# EAGLE design adc_newlayout_newcaps (EAGLE 5.07)
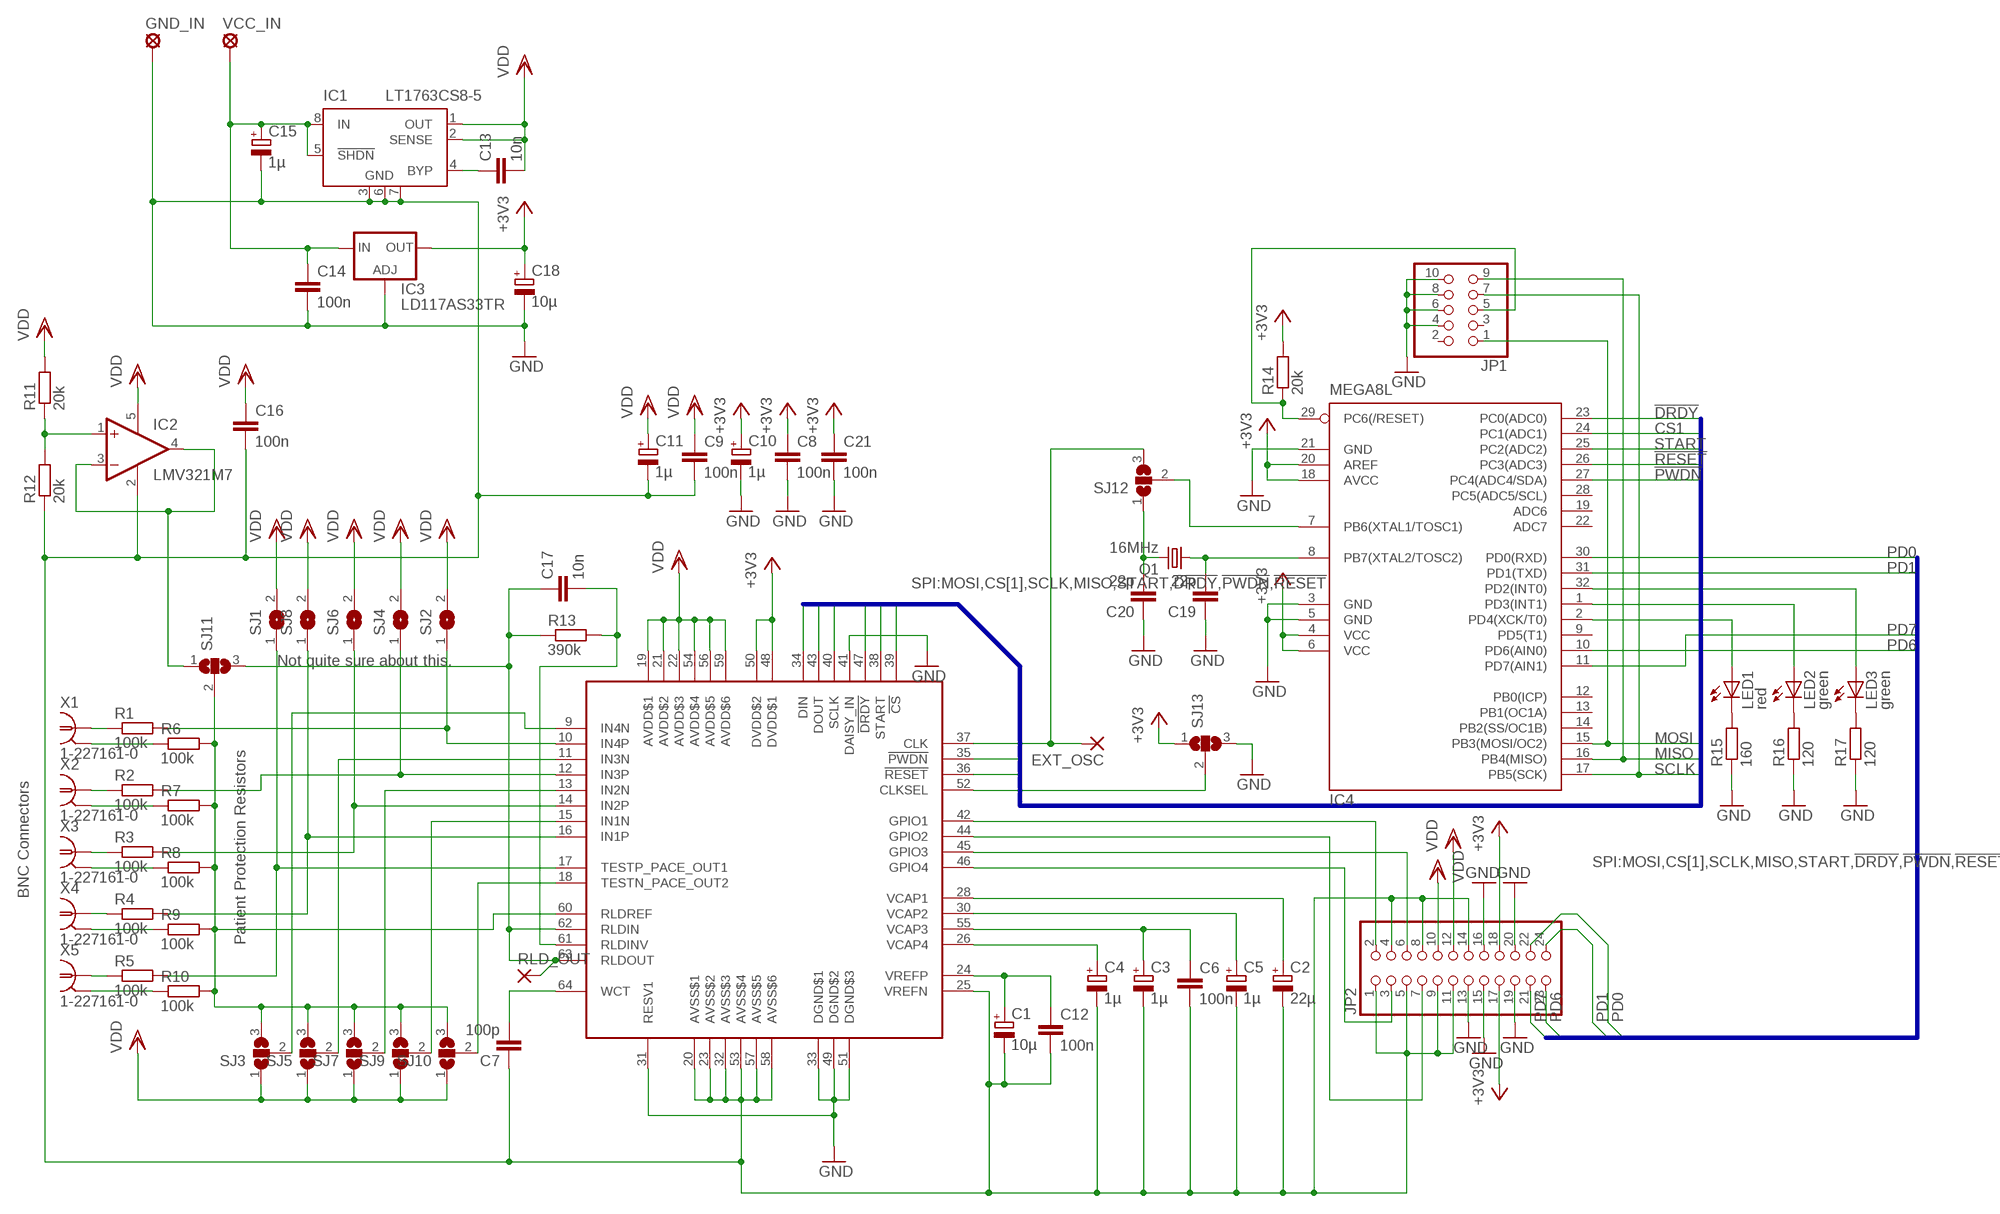
[diagram p0: schematic, sheet 1]

## Parts
C1  10µ  CPOL-EUSMCC  [SMC_C]
C2  22µ  CPOL-EUSMCD  [SMC_D]
C3  1µ  CPOL-EUSMCA  [SMC_A]
C4  1µ  CPOL-EUSMCA  [SMC_A]
C5  1µ  CPOL-EUSMCA  [SMC_A]
C6  100n  C-EUC1206  [C1206]
C7  100p  C-EUC1206  [C1206]
C8  100n  C-EUC1206  [C1206]
C9  100n  C-EUC1206  [C1206]
C10  1µ  CPOL-EUSMCA  [SMC_A]
C11  1µ  CPOL-EUSMCA  [SMC_A]
C12  100n  C-EUC1206  [C1206]
C13  10n  C-EUC1206  [C1206]
C14  100n  C-EUC1206  [C1206]
C15  1µ  CPOL-EUSMCA  [SMC_A]
C16  100n  C-EUC1206  [C1206]
C17  10n  C-EUC1206  [C1206]
C18  10µ  CPOL-EUSMCC  [SMC_C]
C19  22p  C-EUC1206  [C1206]
C20  22p  C-EUC1206  [C1206]
C21  100n  C-EUC1206  [C1206]
EXT_OSC  1,6/0,8  [1,6/0,8]
GND_IN  MCS10B  [MCS10B]
IC1  LT1763CS8-5  LT1763CS8-3.3  [SOIC8]
IC2  LMV321M7  [SC70-5L]
IC3  LD117AS33TR  [SOT223]
IC4  MEGA8L  MEGA8-AI  [TQFP32-08]
JP1  PINHD-2X5  [2X05]
JP2  PINHD-2X12  [2X12]
LED1  red  LEDCHIPLED_1206  [CHIPLED_1206]
LED2  green  LEDCHIPLED_1206  [CHIPLED_1206]
LED3  green  LEDCHIPLED_1206  [CHIPLED_1206]
Q1  16MHz  CRYSTALHC49UP  [HC49UP]
R1  100k  R-EU_R1206  [R1206]
R2  100k  R-EU_R1206  [R1206]
R3  100k  R-EU_R1206  [R1206]
R4  100k  R-EU_R1206  [R1206]
R5  100k  R-EU_R1206  [R1206]
R6  100k  R-EU_R1206  [R1206]
R7  100k  R-EU_R1206  [R1206]
R8  100k  R-EU_R1206  [R1206]
R9  100k  R-EU_R1206  [R1206]
R10  100k  R-EU_R1206  [R1206]
R11  20k  R-EU_R1206  [R1206]
R12  20k  R-EU_R1206  [R1206]
R13  390k  R-EU_R1206  [R1206]
R14  20k  R-EU_R1206  [R1206]
R15  160  R-EU_R1206  [R1206]
R16  120  R-EU_R1206  [R1206]
R17  120  R-EU_R1206  [R1206]
RLD_OUT  2,54/1,0  [2,54/1,0]
SJ1  SJ  [SJ]
SJ2  SJ  [SJ]
SJ3  SJ2W  [SJ_2]
SJ4  SJ  [SJ]
SJ5  SJ2W  [SJ_2]
SJ6  SJ  [SJ]
SJ7  SJ2W  [SJ_2]
SJ8  SJ  [SJ]
SJ9  SJ2W  [SJ_2]
SJ10  SJ2W  [SJ_2]
SJ11  SJ2W  [SJ_2]
SJ12  SJ2W  [SJ_2]
SJ13  SJ2W  [SJ_2]
U$1  ADS1194  [TQFP-64]
VCC_IN  MCS10B  [MCS10B]
X1  1-227161-0  [AMP_227161]
X2  1-227161-0  [AMP_227161]
X3  1-227161-0  [AMP_227161]
X4  1-227161-0  [AMP_227161]
X5  1-227161-0  [AMP_227161]

## Nets
!DRDY: IC4.23(PC0(ADC0)) U$1.47(!DRDY)
!PWDN: IC4.27(PC4(ADC4/SDA)) U$1.35(!PWDN)
!RESET: IC4.26(PC3(ADC3)) U$1.36(!RESET)
CS1: IC4.24(PC1(ADC1)) U$1.39(!CS)
GND: C1.- C2.- C3.- C4.- C5.- C6.2 C7.1 C8.2 C9.2 C10.- C11.- C12.2 C14.2 C15.- C16.2 C18.- C19.1 C20.1 C21.2 GND_IN.MP IC1.3(GND) IC1.6(GND) IC1.7(GND) IC2.2(V-) IC3.1(ADJ) IC4.3(GND) IC4.5(GND) IC4.21(GND) JP1.4 JP1.6 JP1.8 JP1.10 JP2.1 JP2.4 JP2.5 JP2.8 JP2.9 JP2.11 JP2.13 JP2.14 JP2.15 JP2.16 JP2.19 JP2.20 R12.1 R15.1 R16.1 R17.1 SJ13.3 U$1.20(AVSS$1) U$1.23(AVSS$2) U$1.25(VREFN) U$1.31(RESV1) U$1.32(AVSS$3) U$1.33(DGND$1) U$1.41(DAISY_IN) U$1.49(DGND$2) U$1.51(DGND$3) U$1.53(AVSS$4) U$1.57(AVSS$5) U$1.58(AVSS$6)
MISO: IC4.16(PB4(MISO)) JP1.9 U$1.43(DOUT)
MOSI: IC4.15(PB3(MOSI/OC2)) JP1.1 U$1.34(DIN)
N$1: C2.+ U$1.28(VCAP1)
N$2: C4.+ U$1.26(VCAP4)
N$3: C7.2 U$1.64(WCT)
N$4: C5.+ U$1.30(VCAP2)
N$5: C3.+ C6.1 U$1.55(VCAP3)
N$6: C1.+ C12.1 U$1.24(VREFP)
N$7: IC2.1(+IN) R11.1 R12.2
N$8: R1.2 SJ2.1 U$1.10(IN4P)
N$9: JP2.6 U$1.45(GPIO3)
N$10: R2.2 SJ4.1 U$1.12(IN3P)
N$11: C14.1 C15.+ IC1.5(!SHDN) IC1.8(IN) IC3.3(IN) VCC_IN.MP
N$12: R3.2 SJ6.1 U$1.14(IN2P)
N$13: R6.2 R7.2 R8.2 R9.2 R10.2 SJ3.3 SJ5.3 SJ7.3 SJ9.3 SJ10.3 SJ11.2 U$1.60(RLDREF)
N$14: R4.2 SJ8.1 U$1.16(IN1P)
N$15: R5.2 SJ1.1 U$1.17(TESTP_PACE_OUT1)
N$16: C13.1 IC1.4(BYP)
N$17: R1.1 X1.1
N$18: R2.1 X2.1
N$19: R3.1 X3.1
N$20: R4.1 X4.1
N$21: R5.1 X5.1
N$22: SJ10.2 U$1.18(TESTN_PACE_OUT2)
N$23: SJ9.2 U$1.15(IN1N)
N$24: SJ7.2 U$1.13(IN2N)
N$25: SJ5.2 U$1.11(IN3N)
N$26: SJ3.2 U$1.9(IN4N)
N$27: R10.1 X5.2(GND)
N$28: R9.1 X4.2(GND)
N$29: R8.1 X3.2(GND)
N$30: R7.1 X2.2(GND)
N$31: R6.1 X1.2(GND)
N$32: IC2.3(-IN) IC2.4(OUT) SJ11.1
N$33: C17.1 R13.1 RLD_OUT.1(P) SJ11.3 U$1.62(RLDIN) U$1.63(RLDOUT)
N$34: C17.2 R13.2 U$1.61(RLDINV)
N$35: C20.2 Q1.2 SJ12.1
N$36: EXT_OSC.1(P) SJ12.3 U$1.37(CLK)
N$37: IC4.29(PC6(/RESET)) JP1.5 R14.1
N$38: C19.2 IC4.8(PB7(XTAL2/TOSC2)) Q1.1
N$39: SJ13.2 U$1.52(CLKSEL)
N$40: IC4.7(PB6(XTAL1/TOSC1)) SJ12.2
N$41: IC4.32(PD2(INT0)) LED3.A
N$42: IC4.1(PD3(INT1)) LED2.A
N$43: IC4.2(PD4(XCK/T0)) LED1.A
N$44: LED1.C R15.2
N$45: LED2.C R16.2
N$46: LED3.C R17.2
N$47: JP2.3 U$1.46(GPIO4)
N$49: JP2.2 U$1.42(GPIO1)
N$50: C9.1 C11.+ C13.2 C16.1 IC1.1(OUT) IC1.2(SENSE) IC2.5(V+) JP2.10 JP2.12 R11.2 SJ1.2 SJ2.2 SJ3.1 SJ4.2 SJ5.1 SJ6.2 SJ7.1 SJ8.2 SJ9.1 SJ10.1 U$1.19(AVDD$1) U$1.21(AVDD$2) U$1.22(AVDD$3) U$1.54(AVDD$4) U$1.56(AVDD$5) U$1.59(AVDD$6) ; supply symbol labelled VDD
N$52: JP2.7 U$1.44(GPIO2)
N$53: C8.1 C10.+ C18.+ C21.1 IC3.4(OUT) IC4.4(VCC) IC4.6(VCC) IC4.18(AVCC) IC4.20(AREF) JP2.17 JP2.18 R14.2 SJ13.1 U$1.48(DVDD$1) U$1.50(DVDD$2) ; supply symbol labelled +3V3
PD0: IC4.30(PD0(RXD)) JP2.22
PD1: IC4.31(PD1(TXD)) JP2.24
PD6: IC4.10(PD6(AIN0)) JP2.23
PD7: IC4.11(PD7(AIN1)) JP2.21
SCLK: IC4.17(PB5(SCK)) JP1.7 U$1.40(SCLK)
START: IC4.25(PC2(ADC2)) U$1.38(START)
Unconnected: IC4.9(PD5(T1)) IC4.12(PB0(ICP)) IC4.13(PB1(OC1A)) IC4.14(PB2(SS/OC1B)) IC4.19(ADC6) IC4.22(ADC7) IC4.28(PC5(ADC5/SCL)) JP1.2 JP1.3

## Buses
SPI:MOSI,CS[1],SCLK,MISO,START,!DRDY,!PWDN,!RESET
AUX:PD0,PD1,PD6,PD7

## Notes on the sheet
- Not quite sure about this.
- BNC Connectors
- Patient Protection Resistors

## Library data of the parts
C1-C5 C10 C11 C15 C18 = rcl:CPOL-EU: POLARIZED CAPACITOR, European symbol
C6-C9 C12-C14 C16 C17 C19-C21 = rcl:C-EU: CAPACITOR, European symbol
EXT_OSC = wirepad:1,6/0,8: THROUGH-HOLE PAD
GND_IN VCC_IN = solpad:MCS10B: SOLDER PAD MC S1, distributor Buerklin, 15F505
IC1 = linear-technology:LT1763CS8: 500mA, Low Noise, LDO Micropower Regulators Source: http://cds.linear.com/docs/Datasheet/1763ff.pdf
IC2 = linear:LMV321?*: General Purpose, Low Voltage, Rail-to-Rail Output Operational Amplifiers Source: http://www.national.com/mpf/LM/LMV321.html http://www.national.com/dt/lmv_qual.pdf
IC3 = v-reg:LD117A?*: Low drop fixed and adjustable positive voltage regulators 1 A Source: http://www.st.com/stonline/products/literature/ds/7194/ld1117axx.pdf
IC4 = atmel:MEGA8: MICROCONTROLLER 8 Kbytes FLASH, 1 kbytes SRAM, 512 bytes EEPROM, USART, 6-channel 10 bit ADC, 2-channel 8 bit ADC Pin compatible with Atmega48, ATMega88, ATMega168 Source: avr.lbr
JP1 = pinhead:PINHD-2X5: PIN HEADER
JP2 = pinhead:PINHD-2X12: PIN HEADER
LED1-LED3 = led:LED: LED OSRAM: - CHIPLED LG R971, LG N971, LY N971, LG Q971, LY Q971, LO R971, LY R971 LH N974, LH R974 LS Q976, LO Q976, LY Q976 LO Q996 - Hyper CHIPLED LW Q18S LB Q993, LB Q99A, LB R99A - SideLED LS A670, LO A670, LY A670, LG A670, LP A670 LB A673, LV A673, LT A673, LW A673 LH A674 LY A675 LS A676, LA A676, LO A676, LY A676, LW A676 LS A679, LY A679, LG A679 - Hyper Micro SIDELED® LS Y876, LA Y876, LO Y876, LY Y876 LT Y87S - SmartLED LW L88C, LW L88S LB L89C, LB L89S, LG L890 LS L89K, LO L89K, LY L89K LS L896, LA L896, LO L896, LY L896 - TOPLED LS T670, LO T670, LY T670, LG T670, LP T670 LSG T670, LSP T670, LSY T670, LOP T670, LYG T670 LG T671, LOG T671, LSG T671 LB T673, LV T673, LT T673, LW T673 LH T674 LS T676, LA T676, LO T676, LY T676, LB T676, LH T676, LSB T676, LW T676 LB T67C, LV T67C, LT T67C, LS T67K, LO T67K, LY T67K, LW E67C LS E67B, LA E67B, LO E67B, LY E67B, LB E67C, LV E67C, LT E67C LW T67C LS T679, LY T679, LG T679 LS T770, LO T770, LY T770, LG T770, LP T770 LB T773, LV T773, LT T773, LW T773 LH T774 LS E675, LA E675, LY E675, LS T675 LS T776, LA T776, LO T776, LY T776, LB T776 LHGB T686 LT T68C, LB T68C - Hyper Mini TOPLED® LB M676 - Mini TOPLED Santana® LG M470 LS M47K, LO M47K, LY M47K Source: http://www.osram.convergy.de LUXEON: - LUMILED® LXK2-PW12-R00, LXK2-PW12-S00, LXK2-PW14-U00, LXK2-PW14-V00 LXK2-PM12-R00, LXK2-PM12-S00, LXK2-PM14-U00 LXK2-PE12-Q00, LXK2-PE12-R00, LXK2-PE12-S00, LXK2-PE14-T00, LXK2-PE14-U00 LXK2-PB12-K00, LXK2-PB12-L00, LXK2-PB12-M00, LXK2-PB14-N00, LXK2-PB14-P00, LXK2-PB14-Q00 LXK2-PR12-L00, LXK2-PR12-M00, LXK2-PR14-Q00, LXK2-PR14-R00 LXK2-PD12-Q00, LXK2-PD12-R00, LXK2-PD12-S00 LXK2-PH12-R00, LXK2-PH12-S00 LXK2-PL12-P00, LXK2-PL12-Q00, LXK2-PL12-R00 Source: www.luxeon.com KINGBRIGHT: KA-3528ASYC Source: www.kingbright.com
Q1 = crystal:CRYSTAL: CRYSTAL
R1-R17 = rcl:R-EU_: RESISTOR, European symbol
RLD_OUT = wirepad:2,54/1,0: THROUGH-HOLE PAD
SJ1 SJ2 SJ4 SJ6 SJ8 = jumper:SJ: SMD solder JUMPER
SJ3 SJ5 SJ7 SJ9-SJ13 = jumper:SJ2W: SMD solder JUMPER
U$1 = mytexas:ADS1194: Low-Power, 8-Channel, 16-Bit Analog Front-End for Biopotential Measurements for ECG/EEG applications
X1-X5 = con-coax:?227161*: JACK, RIGHT ANGLE, 50 OHM, PCB, BNC Source: amp_227161.pdf

## Board
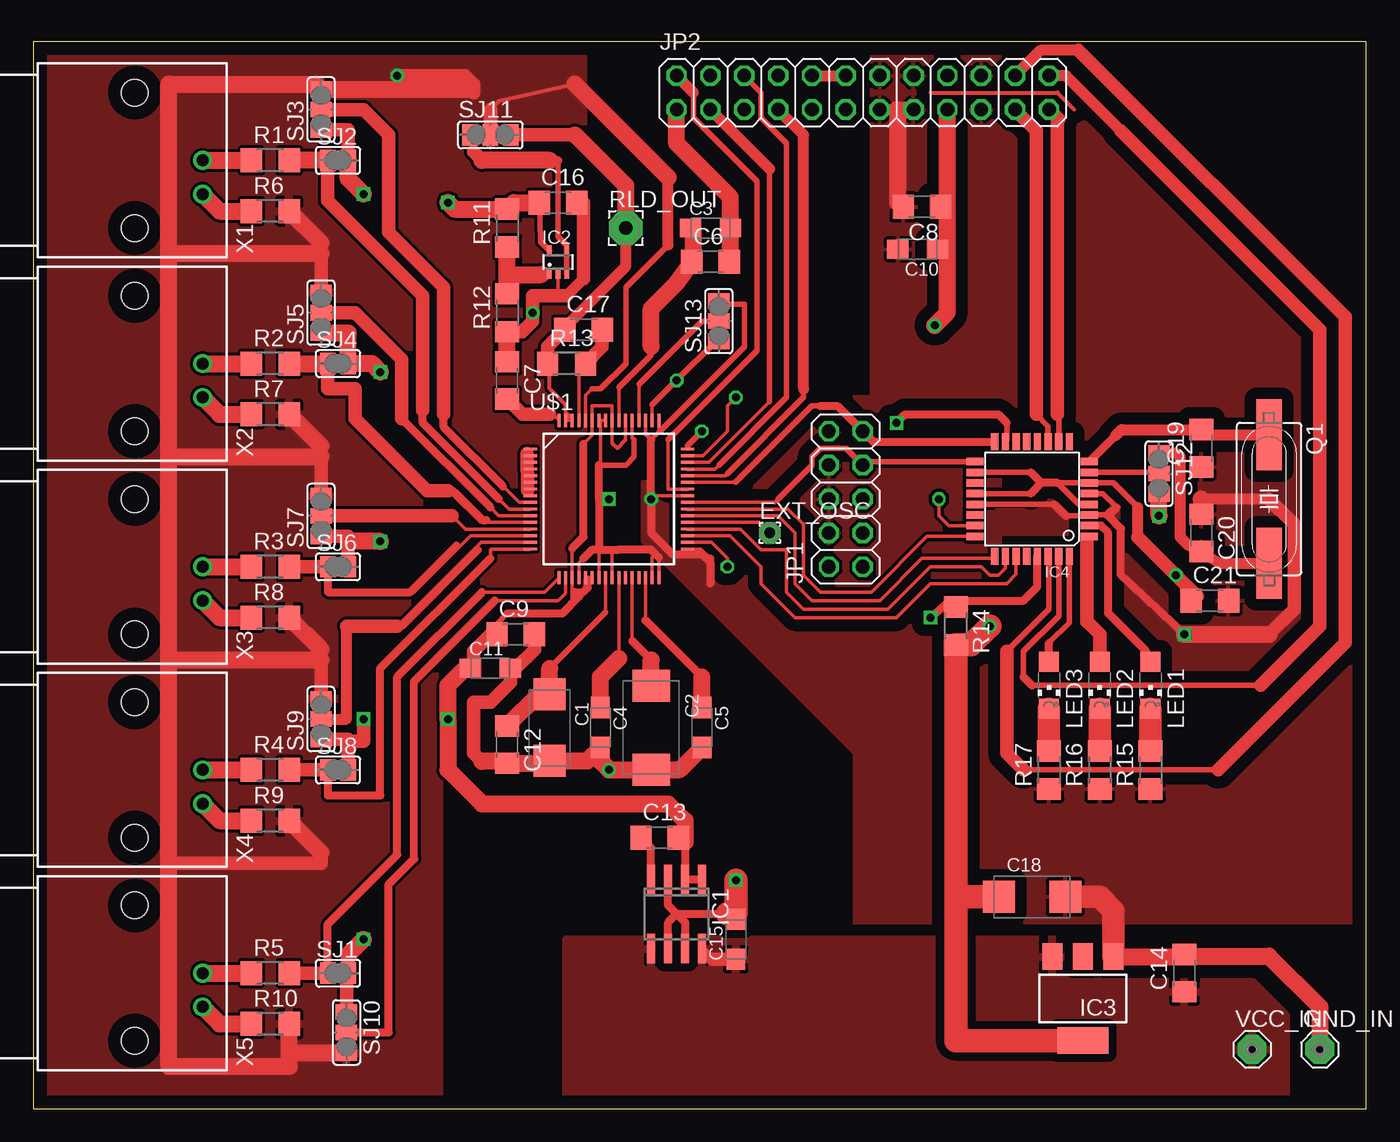
[diagram p1: board, top side]
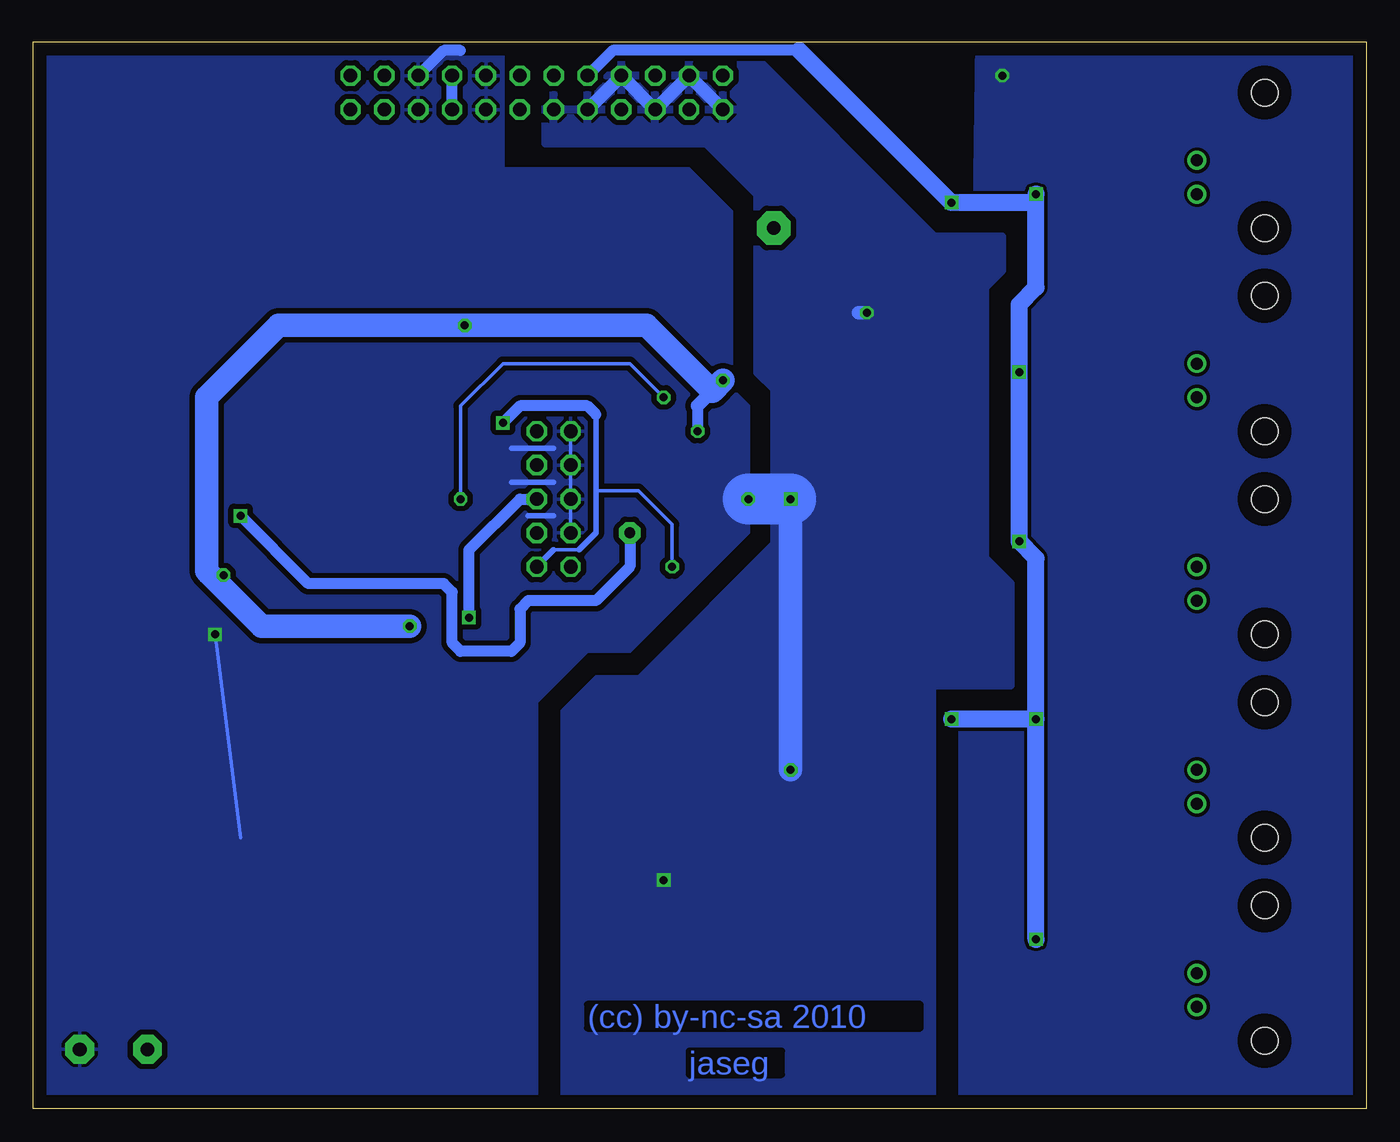
[diagram p2: board, bottom side, seen from below]

Size 100 x 80 mm. Coordinates in mm from the lower left corner, seen from the top.
Outline: 0,0 100,0 100,80 0,80 0,0
Copper layers (1*16): Top 0.035mm / dielectric 1.5mm / Bottom 0.035mm
Design rules "default": minimum track width 10mil, minimum drill 24mil, track to track 8mil, track to pad 8mil, pad to pad 8mil, via to via 8mil, smd to smd 8mil, copper to edge 40mil, drill to drill 8mil, minimum pad ring 10mil, minimum via ring 8mil, stop-mask expansion 4mil, vias tented up to drill 0mil, thermal gap 10mil

### Footprints (pad centres in the part's own frame; a part is rotated, then mirrored left to right if it is on the bottom)
SMC_C = smd 2.4 x 2.4: + -2.5,0; - 2.5,0
SMC_D = smd 2.4 x 2.8: + -3.15,0; - 3.15,0
SMC_A = smd 1.6 x 1.4: + -1.5,0; - 1.5,0
C1206 = smd 1.6 x 1.8: 1 -1.4,0; 2 1.4,0
1,6/0,8 = drill 0.813 pad 1.6 octagon: 1 0,0
MCS10B = drill 1.016 pad 2.159 octagon: MP 0,0
SOIC8 = smd 0.6 x 2.2: 1 -1.905,-2.6; 2 -0.635,-2.6; 3 0.635,-2.6; 4 1.905,-2.6; 5 1.905,2.6; 6 0.635,2.6; 7 -0.635,2.6; 8 -1.905,2.6
SC70-5L = smd 0.35 x 0.8: 1 -0.65,-0.85; 2 0,-0.85; 3 0.65,-0.85; 4 0.65,0.85; 5 -0.65,0.85
SOT223 = smd 1.5 x 2: 1 -2.3,-3.15; 2 0,-3.15; 3 2.3,-3.15 | smd 3.8 x 2: 4 0,3.15
TQFP32-08 = smd 1.27 x 0.559: 1 -4.293,2.8; 2 -4.293,2; 3 -4.293,1.2; 4 -4.293,0.4; 5 -4.293,-0.4; 6 -4.293,-1.2; 7 -4.293,-2; 8 -4.293,-2.8; 17 4.293,-2.8; 18 4.293,-2; 19 4.293,-1.2; 20 4.293,-0.4; 21 4.293,0.4; 22 4.293,1.2; 23 4.293,2; 24 4.293,2.8 | smd 0.559 x 1.27: 9 -2.8,-4.293; 10 -2,-4.293; 11 -1.2,-4.293; 12 -0.4,-4.293; 13 0.4,-4.293; 14 1.2,-4.293; 15 2,-4.293; 16 2.8,-4.293; 25 2.8,4.293; 26 2,4.293; 27 1.2,4.293; 28 0.4,4.293; 29 -0.4,4.293; 30 -1.2,4.293; 31 -2,4.293; 32 -2.8,4.293
2X05 = drill 1.016 octagon: 1 -5.08,-1.27; 2 -5.08,1.27; 3 -2.54,-1.27; 4 -2.54,1.27; 5 0,-1.27; 6 0,1.27; 7 2.54,-1.27; 8 2.54,1.27; 9 5.08,-1.27; 10 5.08,1.27
2X12 = drill 1.016 octagon: 1 -13.97,-1.27; 2 -13.97,1.27; 3 -11.43,-1.27; 4 -11.43,1.27; 5 -8.89,-1.27; 6 -8.89,1.27; 7 -6.35,-1.27; 8 -6.35,1.27; 9 -3.81,-1.27; 10 -3.81,1.27; 11 -1.27,-1.27; 12 -1.27,1.27; 13 1.27,-1.27; 14 1.27,1.27; 15 3.81,-1.27; 16 3.81,1.27; 17 6.35,-1.27; 18 6.35,1.27; 19 8.89,-1.27; 20 8.89,1.27; 21 11.43,-1.27; 22 11.43,1.27; 23 13.97,-1.27; 24 13.97,1.27
CHIPLED_1206 = smd 1.5 x 1.5: A 0,-1.75; C 0,1.75
HC49UP = smd 5.334 x 1.93: 1 -4.826,0; 2 4.826,0
R1206 = smd 1.6 x 1.803: 1 -1.422,0; 2 1.422,0
2,54/1,0 = drill 1.016 pad 2.54 octagon: 1 0,0
SJ = smd 1.168 x 1.6: 1 -0.762,0; 2 0.762,0
SJ_2 = smd 1.168 x 1.6: 1 -1.524,0; 2 0,0; 3 1.524,0
TQFP-64 = smd 1 x 0.22: 1 -5.9,3.75; 2 -5.9,3.25; 3 -5.9,2.75; 4 -5.9,2.25; 5 -5.9,1.75; 6 -5.9,1.25; 7 -5.9,0.75; 8 -5.9,0.25; 9 -5.9,-0.25; 10 -5.9,-0.75; 11 -5.9,-1.25; 12 -5.9,-1.75; 13 -5.9,-2.25; 14 -5.9,-2.75; 15 -5.9,-3.25; 16 -5.9,-3.75; 33 5.9,-3.75; 34 5.9,-3.25; 35 5.9,-2.75; 36 5.9,-2.25; 37 5.9,-1.75; 38 5.9,-1.25; 39 5.9,-0.75; 40 5.9,-0.25; 41 5.9,0.25; 42 5.9,0.75; 43 5.9,1.25; 44 5.9,1.75; 45 5.9,2.25; 46 5.9,2.75; 47 5.9,3.25; 48 5.9,3.75 | smd 0.22 x 1: 17 -3.75,-5.9; 18 -3.25,-5.9; 19 -2.75,-5.9; 20 -2.25,-5.9; 21 -1.75,-5.9; 22 -1.25,-5.9; 23 -0.75,-5.9; 24 -0.25,-5.9; 25 0.25,-5.9; 26 0.75,-5.9; 27 1.25,-5.9; 28 1.75,-5.9; 29 2.25,-5.9; 30 2.75,-5.9; 31 3.25,-5.9; 32 3.75,-5.9; 49 3.75,5.9; 50 3.25,5.9; 51 2.75,5.9; 52 2.25,5.9; 53 1.75,5.9; 54 1.25,5.9; 55 0.75,5.9; 56 0.25,5.9; 57 -0.25,5.9; 58 -0.75,5.9; 59 -1.25,5.9; 60 -1.75,5.9; 61 -2.25,5.9; 62 -2.75,5.9; 63 -3.25,5.9; 64 -3.75,5.9
AMP_227161 = drill 0.9 pad 1.27 round: 1 0,-5.08; 2 -2.54,-5.08 | hole 2: -5.08,0; 5.08,0

### Placement (x,y rotation side)
C1  38.73,28.57 270 top
C2  46.35,28.57 270 top
C3  50.8,66.04 0 top
C4  42.55,28.57 270 top
C5  50.16,28.57 270 top
C6  50.8,63.5 0 top
C7  35.56,54.61 270 top
C8  66.67,67.63 180 top
C9  36.2,35.56 0 top
C10  66.36,64.45 180 top
C11  34.29,33.02 0 top
C12  35.56,27.3 270 top
C13  46.99,20.32 0 top
C14  86.36,10.16 90 top
C15  52.7,12.7 90 top
C16  39.37,67.94 0 top
C17  41.27,58.42 0 top
C18  74.93,15.88 0 top
C19  87.63,49.53 90 top
C20  87.63,43.18 270 top
C21  88.27,38.1 0 top
EXT_OSC  55.24,43.18 0 top
GND_IN  96.52,4.45 0 top
IC1  48.26,14.61 180 top
IC2  39.37,63.5 0 top
IC3  78.74,8.26 180 top
IC4  74.93,45.72 180 top
JP1  60.96,45.72 90 top
JP2  62.23,76.2 0 top
LED1  83.82,31.75 180 top
LED2  80.01,31.75 180 top
LED3  76.2,31.75 180 top
Q1  92.71,45.72 270 top
R1  17.78,71.12 0 top
R2  17.78,55.88 0 top
R3  17.78,40.64 0 top
R4  17.78,25.4 0 top
R5  17.78,10.16 0 top
R6  17.78,67.31 0 top
R7  17.78,52.07 0 top
R8  17.78,36.83 0 top
R9  17.78,21.59 0 top
R10  17.78,6.35 0 top
R11  35.56,66.04 90 top
R12  35.56,59.69 90 top
R13  40.01,55.88 0 top
R14  69.22,36.2 270 top
R15  83.82,25.4 90 top
R16  80.01,25.4 90 top
R17  76.2,25.4 90 top
RLD_OUT  44.45,66.04 0 top
SJ1  22.86,10.16 0 top
SJ2  22.86,71.12 0 top
SJ3  21.59,74.93 90 top
SJ4  22.86,55.88 0 top
SJ5  21.59,59.69 90 top
SJ6  22.86,40.64 0 top
SJ7  21.59,44.45 90 top
SJ8  22.86,25.4 0 top
SJ9  21.59,29.21 90 top
SJ10  23.5,5.71 270 top
SJ11  34.29,73.03 0 top
SJ12  84.45,47.62 270 top
SJ13  51.44,59.05 90 top
U$1  43.18,45.72 0 top
VCC_IN  91.44,4.45 0 top
X1  7.62,71.12 90 top
X2  7.62,55.88 90 top
X3  7.62,40.64 90 top
X4  7.62,25.4 90 top
X5  7.62,10.16 90 top

### Tracks (layer width: path | path; a pad name or v marks a point on that pad's centre or on a via)
!DRDY  (via drill 0.6)
  Top 0.254: U$1.47 50.24,48.97 52.07,50.8 52.07,52.7 v52.7,53.34 | v67.94,45.72 67.94,44.45 68.67,43.72 IC4.23
  Bottom 0.254: v52.7,53.34 55.24,55.88 64.77,55.88 67.94,52.7 v67.94,45.72
!PWDN
  Top 0.254: U$1.35 52.28,42.97 54.61,40.64 54.61,39.37 57.15,36.83 64.77,36.83 67.31,39.37 73.03,39.37 73.73,40.08 IC4.27
!RESET
  Top 0.254: U$1.36 53.05,43.47 54.61,41.91 56.52,41.91 56.52,38.73 57.78,37.47 64.14,37.47 67.31,40.64 71.12,40.64 71.75,40.01 72.39,40.01 72.93,40.55 IC4.26
CS1
  Top 0.254: U$1.39 56.63,44.97 57.78,43.81 57.78,40.01 59.05,38.73 62.87,38.73 67.05,42.92 IC4.24
GND  (via drill 0.6)
  Top 0.254: 50.8,41.27 50.1,41.97 U$1.33 | 46.35,43.18 47.62,41.91 | 46.93,50.74 U$1.49 | 45.93,50.59 U$1.51 | C11.- 35.56,33.02 | U$1.57 U$1.58 42.55,51.51 42.55,48.26 | 44.93,50.32 U$1.53 | 44.45,48.26 42.55,48.26 | 42.55,41.91 42.55,48.26 | U$1.20 40.93,40.93 41.27,41.27 | 41.91,41.91 42.55,41.91 | 46.93,41.34 U$1.32 | 46.35,41.91 43.18,41.91 43.43,41.66 | 43.81,41.91 43.68,41.91 43.43,41.66 | R16.1 80.24,23.75 | 51.69,60.33 SJ13.3 | U$1.41 46.6,45.97 v46.35,45.72 | 43.43,41.66 U$1.25 | IC4.3 79.15,44.45 | 39.37,60.96 IC2.2 | U$1.31 46.43,41.35 46.67,41.59 | 46.35,50.16 53.34,57.15 | U$1.23 42.43,41.8 42.55,41.91
  Top 0.305: 45.09,50.16 44.93,50.32 | 45.93,50.59 46.35,50.16 46.93,50.74
  Top 0.406: 42.43,48.26 44.45,48.26 45.09,48.9 45.09,50.16 | IC4.3 80.58,44.52 80.72,44.52 | IC4.5 80.25,46.12 81.28,45.09 | 51.69,60.33 53.34,60.33 53.34,57.15 46.93,50.74 | 89.53,35.56 89.22,35.88 | 76.6,45.32 IC4.21 | 79.15,44.45 77.47,44.45
  Top 0.61: 47.62,41.91 47.94,41.59 50.16,41.59 50.8,40.96 | 50.8,40.96 50.8,39.37 | 50.8,40.96 50.8,41.27 | C15.- 52.3,14.61 52.07,14.61 48.26,14.61 | 48.26,14.61 47.62,13.97 IC1.6 | 48.26,14.61 48.9,13.97 IC1.7 | 48.26,14.61 47.62,15.24 IC1.3 | 42.43,45.72 42.43,41.91 | 42.43,45.72 42.43,48.26 | 42.43,41.91 41.91,41.91 41.27,41.27 | 46.93,41.34 46.67,41.59 46.35,41.91 43.81,41.91 43.18,41.91 42.55,41.91 42.43,41.91 | v43.18,45.72 42.43,45.72 | 80.72,44.52 80.96,44.77 | 80.96,44.77 81.28,45.09 | 47.56,41.97 46.35,43.18 v46.35,45.72 46.35,50.16 | v86.36,35.56 81.6,40.01 81.6,43.5 80.58,44.52 80.82,44.77 80.96,44.77 | 77.47,44.45 76.6,45.32
  Top 0.813: 40.01,60.96 41.27,62.23 | 64.86,74.84 64.77,74.93 | 64.86,67.94 65.17,67.63 | 92.71,45.72 87.63,45.72
  Top 1.016: C16.2 41.27,67.94 41.27,62.23 | 40.01,60.96 39.37,60.96 37.47,60.96 v37.47,59.69 37.47,59.05 36.68,58.27 R12.1 | 92.71,35.56 94.61,37.47 94.61,43.81 92.71,45.72 | 33.66,26.04 33.02,26.67 33.02,30.48 34.29,30.48 35.79,31.98 C11.- 36.2,33.02 37.59,34.42 C9.2 | 35.43,26.04 C12.2 | 38.56,25.91 C1.- | 41.55,26.07 41.91,26.44 42.14,26.44 | 46.33,25.4 C2.-
  Top 1.27: C6.2 52.3,64.05 C3.- 52.3,68.35 48.26,72.39 JP2.1 | 81.33,11.11 IC3.1 86.2,11.4 C14.2 arc-90 86.68,11.43 92.71,11.43 96.52,7.62 GND_IN.MP | 64.77,74.93 JP2.15 | 64.86,67.94 64.86,74.84 | v86.36,35.56 89.53,35.56 92.71,35.56 | 87.63,45.72 C20.1 | 35.43,26.04 33.66,26.04 | C12.2 38.56,25.91 | C1.- 41.55,26.07 | 41.91,26.44 C4.- | 42.14,26.44 v43.18,25.4 46.33,25.4 | C2.- 48.52,25.43 C5.- | C7.1 R12.1
  Top 1.676: IC3.1 81.04,14.85 80.01,15.88 C18.-
  Top 1.778: 52.07,14.61 52.7,14.61 v52.7,17.14
  Bottom 0.254: 84.45,20.32 v86.36,35.56 | JP1.10 JP1.8 JP1.6 JP1.4
  Bottom 0.406: 60.96,49.53 64.14,49.53 | 60.96,46.99 64.14,46.99 | 60.96,44.45 62.87,44.45
  Bottom 0.813: 67.94,79.38 69.22,79.38 JP2.20
  Bottom 1.016: v37.47,59.69 38.1,59.69 | JP2.1 JP2.4 JP2.5 JP2.8 JP2.9
  Bottom 1.778: v43.18,25.4 v43.18,45.72
  Bottom 3.81: v43.18,45.72 v46.35,45.72
  pour Bottom (isolate 0.406): 61.59,80.01 61.59,72.39 50.16,72.39 49.53,72.39 45.72,68.58 45.72,55.24 44.45,53.98 44.45,42.55 33.66,31.75 26.67,31.75 26.67,39.37 28.57,41.27 28.57,61.59 27.3,62.87 27.3,65.41 32.38,65.41 46.99,80.01
  pour Bottom (isolate 0.254): 43.81,43.18 36.83,35.56 35.56,35.56 32.38,32.38 32.38,0 60.33,0 60.33,29.84 57.78,32.38 54.61,32.38
  pour Top (isolate 0.889): 99.69,80.01 62.87,80.01 62.87,53.34 58.42,53.34 52.07,46.99 45.72,46.99 45.72,42.55 61.59,26.67 61.59,13.97 99.69,13.97
  pour Bottom (isolate 0.406): 100.33,80.01 100.33,44.45 100.33,0 62.23,0 62.23,30.48 58.42,34.29 55.24,34.29 46.35,43.18 46.35,52.7 47.62,53.98 47.62,67.31 50.8,70.48 64.77,70.48 64.77,80.01
MISO
  Top 0.254: U$1.43 52.69,46.97
  Top 0.406: 59.05,52.7 58.42,52.7 52.69,46.97
  Top 0.61: 59.05,52.7 60.33,52.7 JP1.9 63.02,50.01 IC4.16
MOSI  (via drill 0.6)
  Top 0.254: 73.03,50.11 IC4.15 | U$1.34 50.88,42.47 52.07,41.27 v52.07,40.64
  Top 0.406: 73.03,51.44 73.03,50.11
  Top 0.61: 73.03,51.44 72.39,52.07 65.41,52.07 v64.77,51.44
  Bottom 0.254: 59.05,41.91 60.96,41.91 | v52.07,40.64 52.07,43.81 54.61,46.35 57.78,46.35
  Bottom 0.406: 60.96,41.91 JP1.1 | 59.05,41.91 57.78,43.18 57.78,46.35 57.78,52.07
  Bottom 0.813: 57.78,52.07 58.42,52.7 63.5,52.7 v64.77,51.44
N$1
  Top 0.254: 44.93,35.08 U$1.28
  Top 0.61: 46.35,33.66 44.93,35.08
  Top 1.27: C2.+ 46.35,33.66
N$2
  Top 0.254: 43.93,33.77 U$1.26
  Top 1.27: 43.93,33.77 42.55,32.38 C4.+
N$3
  Top 0.254: 39.43,51.69 U$1.64 38.98,52.07 38.73,52.07
  Top 1.016: C7.2 36.7,52.07 38.73,52.07
N$4
  Top 0.254: 45.93,36.62 U$1.30
  Top 0.61: 50.16,32.38 45.93,36.62
  Top 1.27: C5.+ 50.16,32.38
N$5
  Top 0.254: C6.1 49.53,63.5 | U$1.55 43.93,54.09
  Top 0.305: 49.53,65.81 C3.+
  Top 0.406: 43.93,54.09 46.35,56.52 46.35,57.15
  Top 1.27: C6.1 48.26,61.91 46.35,60.01 46.35,57.15 | 49.53,63.5 49.53,65.81
N$6
  Top 0.254: 42.93,37.22 U$1.24
  Top 0.406: 38.73,33.02 42.93,37.22
  Top 1.016: 37.93,31.07 C1.+
  Top 1.27: C1.+ 38.73,33.02 | C12.1 37.93,31.07
N$7
  Top 0.254: IC2.1 38.2,62.65 38.1,62.55
  Top 0.61: 38.1,62.55 38.42,62.55
  Top 1.27: R12.2 35.56,62.87 | 35.56,62.87 R11.1 | 38.1,62.55 35.88,62.55 35.56,62.87
N$8
  Top 0.254: U$1.10 35.67,44.97 34.92,45.72
  Top 0.61: 29.21,52.39 29.21,51.44 34.92,45.72
  Top 1.016: SJ2.1 22.1,68.07 29.21,60.96 29.21,52.39
  Top 1.27: SJ2.1 R1.2
N$9
  Top 0.254: U$1.45 51.15,47.97 51.44,48.26
  Top 0.406: 51.44,48.26 56.52,53.34 56.52,72.39 54.61,74.3 54.61,76.2 JP2.6
N$10
  Top 0.254: U$1.12 34.13,43.97 33.97,44.13 31.75,46.35 31.43,46.35 31.11,46.35
  Top 0.61: 31.43,46.35 33.66,44.13 33.97,44.13
  Top 1.016: SJ4.1 22.1,53.98 24.13,53.98 24.13,51.75 29.53,46.35 31.11,46.35
  Top 1.27: R2.2 SJ4.1
N$11
  Top 0.254: IC3.3 76.83,11.01
  Top 0.61: IC1.8 50.97,11.2
  Top 1.016: 50.97,11.2 C15.+
  pour Top (isolate 0.61): 93.98,6.99 93.98,0 40.01,0 40.01,12.7 76.83,12.7 80.01,9.53 91.44,9.53
N$12
  Top 0.254: U$1.14 32.81,42.97 28.57,38.73 28.26,38.73
  Top 0.61: SJ6.1 22.1,38.73 28.26,38.73 31.75,42.23
  Top 1.016: R3.2 SJ6.1
N$13  (via drill 0.6)
  Top 0.254: 21.59,33.66 21.59,34.44 | 21.59,48.9 21.59,49.68 | 21.59,64.14 21.59,64.92 | R7.2 19.05,51.92 | U$1.60 41.43,53.49 41.91,53.98
  Top 0.305: 40.64,76.83 34.92,75.56 34.29,74.93
  Top 0.406: 41.91,53.98 42.55,53.98 44.45,55.88 44.45,61.59 47.62,64.77
  Top 0.813: 47.62,64.77 47.62,69.85
  Top 1.016: 21.59,19.2 21.59,18.41 10.16,18.41 | 21.59,33.66 SJ9.3 | 21.59,48.9 SJ7.3 | 21.59,64.14 SJ5.3 | 21.21,76.83 SJ3.3 | 34.29,74.93 SJ11.2 | v27.3,77.47 32.38,77.47 33.02,76.83 33.02,76.2 32.77,76.45
  Top 1.27: 21.59,19.2 R9.2 | 21.59,34.44 R8.2 | 21.59,49.68 R7.2 | 21.59,64.92 R6.2 | 10.16,48.9 10.16,64.14 | 10.16,64.14 21.59,64.14 | 21.21,76.83 10.16,76.83 10.16,64.14 | 10.16,48.9 21.59,48.9 | 10.16,33.66 10.16,48.9 | 10.16,33.66 21.59,33.66 | 10.16,33.66 10.16,18.41 10.16,3.17 19.2,3.17 19.2,4.19 | 19.2,4.19 R10.2 | 19.2,4.19 SJ10.3 | SJ3.3 32.77,76.45 | 47.62,69.85 40.64,76.83
  pour Bottom (isolate 0.254): 29.21,80.01 29.84,37.47 30.48,36.83 30.48,0 0,0 0,80.01
  pour Top (isolate 0.22): 0,80.01 0,0 30.48,0 30.48,33.02 34.92,37.47 36.83,37.47 41.27,41.91 41.27,80.01
N$14
  Top 0.254: U$1.16 34.35,41.97 34.29,41.91 34.29,41.27
  Top 0.61: 34.29,41.27 26.04,33.02 26.04,23.5 22.1,23.5 SJ8.1
  Top 1.016: R4.2 SJ8.1
N$15
  Top 0.254: 33.66,38.73 38.34,38.73 U$1.17
  Top 0.61: 33.66,38.73 27.3,32.38 27.3,19.05 22.1,13.84 SJ1.1
  Top 1.016: R5.2 SJ1.1
N$16
  Top 0.61: IC1.4 46.35,19.55 C13.1
N$17
  Top 1.27: X1.1 R1.1
N$18
  Top 1.27: X2.1 R2.1
N$19
  Top 1.27: X3.1 R3.1
N$20
  Top 1.27: X4.1 R4.1
N$21
  Top 1.27: X5.1 R5.1
N$22
  Top 0.254: U$1.18 39.93,38.66 39.37,38.1 34.61,38.1
  Top 0.61: SJ10.2 26.67,5.71 26.67,16.83 28.57,18.73 28.57,32.07 34.61,38.1
N$23
  Top 0.254: U$1.15 33.58,42.47 27.3,36.2
  Top 0.813: SJ9.2 23.5,29.21 23.5,36.2
  Top 1.016: 23.5,36.2 27.3,36.2
N$24
  Top 0.254: U$1.13 32.41,43.47 31.43,44.45
  Top 1.016: SJ7.2 31.43,44.45
N$25
  Top 0.254: U$1.11 34.91,44.47 34.29,45.09
  Top 0.61: 34.29,45.09 27.62,51.75
  Top 1.016: SJ5.2 24.13,59.69 27.62,56.2 27.62,51.75
N$26
  Top 0.254: U$1.9 36.45,45.47 35.24,46.67
  Top 0.61: 30.8,52.07 30.8,51.12 35.24,46.67
  Top 1.016: SJ3.2 24.77,74.93 26.67,73.03 26.67,65.72 30.8,61.59 30.8,52.07
N$27
  Top 1.27: R10.1 13.97,6.35 X5.2
N$28
  Top 1.27: R9.1 13.97,21.59 X4.2
N$29
  Top 1.27: R8.1 13.97,36.83 X3.2
N$30
  Top 1.27: R7.1 13.97,52.07 X2.2
N$31
  Top 1.27: R6.1 13.97,67.31 X1.2
N$32
  Top 0.254: IC2.3 IC2.4 | 33.02,72.77 SJ11.1
  Top 0.406: IC2.3 40.02,64.75 39.37,65.41 39.37,71.12
  Top 0.61: 39.37,71.12 38.73,71.12 | 33.02,71.75 33.02,72.77
  Top 1.016: 33.66,71.12 33.02,71.75
  Top 1.27: 38.73,71.12 33.66,71.12
N$33
  Top 0.254: U$1.62 U$1.63 39.93,52.78
  Top 0.305: 39.93,52.78 38.73,53.98 38.73,55.73 R13.1
  Top 0.813: RLD_OUT.1 44.45,63.5 44.45,63.18 39.88,58.61
  Top 1.016: 40.64,73.03 SJ11.3 | R13.1 38.58,57.13 C17.1 39.88,58.61
  Top 1.27: 40.64,73.03 44.45,69.22 RLD_OUT.1
N$34
  Top 0.254: U$1.61 40.93,55.38
  Top 0.305: 40.93,55.38 R13.2
  Top 1.016: R13.2 42.67,57.13 C17.2
N$35
  Top 0.813: Q1.2 88.97,40.89 C20.2 87.63,42.23 86.68,42.23 86.04,42.86 86.04,48.9 85.79,49.15 SJ12.1
N$36  (via drill 0.6)
  Top 0.254: U$1.37 54.45,43.97 EXT_OSC.1
  Top 1.27: v84.45,44.45 SJ12.3
  Bottom 0.813: EXT_OSC.1 55.24,40.64 57.78,38.1 62.87,38.1 63.5,37.47 63.5,34.92 64.14,34.29 67.94,34.29 68.58,34.92 68.58,38.73 69.22,39.37 79.38,39.37 v84.45,44.45
N$37  (via drill 0.6)
  Top 0.254: 68.73,38.1 R14.1 69.7,38.1
  Top 0.61: v67.31,36.83 68.73,38.1 | IC4.29 75.33,39.13 74.3,38.1 69.7,38.1
  Bottom 0.813: JP1.5 63.5,45.72 67.31,41.91 v67.31,36.83
N$38
  Top 0.254: C19.2 87.7,50.55
  Top 0.61: IC4.8 81.18,50.48
  Top 0.813: 87.7,50.55 Q1.1 | 81.18,50.48 81.63,50.93 C19.2
N$39
  Top 0.254: U$1.52 45.43,54.32
  Top 0.406: 45.43,54.32 50.16,59.05 SJ13.2
N$40
  Top 0.406: IC4.7 84.36,47.72 SJ12.2
N$41
  Top 0.406: IC4.32 77.73,36.45 76.2,34.92
  Top 0.61: LED3.A 76.2,34.92
N$42
  Top 0.254: 79.22,36.35 IC4.1
  Top 1.016: 79.22,36.35 80.01,35.56 LED2.A
N$43
  Top 0.61: IC4.2 80.11,43.72 80.64,43.18 80.64,37.15 83.5,34.29 83.5,33.82 LED1.A
N$44
  Top 1.676: R15.2 LED1.C
N$45
  Top 1.676: R16.2 LED2.C
N$46
  Top 1.676: R17.2 LED3.C
N$47
  Top 0.254: U$1.46 50.69,48.47 55.24,53.02
  Top 0.406: 55.24,53.02 55.24,70.48
  Top 0.813: 55.24,70.48 JP2.3
N$48
  Top 1.016: 79.06,36.51 79.06,42.55
N$49
  Top 0.254: U$1.42 47.62,46.47 47.62,50.16
  Top 0.406: 47.62,50.16 54.29,56.83 54.29,69.53 49.53,74.3 49.53,76.2
  Top 0.813: 49.53,76.2 JP2.2
N$50  (via drill 0.6)
  Top 0: U$1.59 41.91,51.6
  Top 0.254: 23.5,10.16 SJ1.2 | 23.88,42.55 23.5,42.93 | U$1.22 U$1.21 41.43,38.89 41.27,38.73 | 40.43,38.95 U$1.19 40.43,42.02 | 40.43,38.95 40.64,38.73 | 40.43,38.95 40.43,37.89 39.69,37.15 | 43.43,49.91 U$1.56 43.43,52.7 41.93,52.7 U$1.59 41.93,50.5 41.27,49.85 | 44.43,50.15 U$1.54
  Top 0.305: 43.43,49.91 43.81,49.53 44.43,50.15
  Top 0.406: 23.5,42.93 23.62,42.93 | IC2.5 38.05,65.02 C16.1 | 35.56,37.15 34.8,36.38 C9.1
  Top 0.61: 40.64,38.73 41.27,38.73 41.59,39.05 41.59,39.69 | 41.27,49.85 41.27,48.9 41.3,42.88 40.43,42.02 | IC1.1 IC1.2 48.9,20 | 35.56,37.15 39.69,37.15 40.96,38.42 | 23.62,27.56 23.62,27.69
  Top 0.813: JP2.10 JP2.12 | 32.16,32.79 C11.+
  Top 1.016: SJ3.1 23.62,73.41 SJ2.2 | 23.5,42.93 SJ7.1 | 23.62,42.93 SJ6.2 | SJ10.1 23.5,10.16 | SJ1.2 23.62,11.56 | v24.77,29.21 24.77,27.56 23.62,27.56 SJ8.2 | 23.62,27.69 SJ9.1 | C9.1 34.29,35.56 33.02,34.29 33.02,33.25 C11.+
  Top 1.27: SJ5.1 23.62,58.17 SJ4.2 25.4,55.88 v26.04,55.24 | 23.62,11.56 v24.77,12.7 | v26.04,42.55 23.88,42.55 | SJ2.2 23.62,69.72 v24.77,68.58 | C16.1 36.04,67.94 R11.2 31.6,67.46 v31.11,67.94 | 32.16,32.79 31.11,31.75 v31.11,29.21 31.11,25.4 33.66,22.86 47.62,22.86 48.9,21.59 48.9,20 48.71,20 C13.2
  Bottom 0.254: v24.77,68.58 25.4,67.94
  Bottom 0.813: JP2.10 56.52,79.38 42.55,79.38
  Bottom 1.27: v24.77,12.7 v24.77,29.21 | v24.77,29.21 24.77,41.27 v26.04,42.55 v26.04,55.24 26.04,60.33 24.77,61.59 v24.77,68.58 | 25.4,67.94 v31.11,67.94 42.55,79.38 | v24.77,29.21 v31.11,29.21
N$51
  pour Top (isolate 0.254): 60.33,39.37 60.33,48.9 60.96,48.26 71.75,48.26 72.39,47.62 72.39,37.47 70.48,39.37
N$52
  Top 0.254: 52.07,47.62 51.91,47.47 U$1.44
  Top 0.406: 57.78,53.98 57.78,53.34 52.07,47.62
  Top 0.813: JP2.7 57.78,73.03 57.78,53.98
N$53  (via drill 0.6)
  Top 0.254: 46.43,52.78 U$1.50 | 49.08,49.72 U$1.48
  Top 0.406: 46.43,52.78 v48.26,54.61 51.18,57.53 SJ13.1 | 74.83,47.72 IC4.18 | 74.83,46.12 IC4.20 | IC4.4 78.44,45.32 76.83,46.92 IC4.6 81.03,46.92 82.87,45.09 | v50.16,50.8 49.08,49.72
  Top 0.61: 76.83,46.92 75.64,46.92 | 75.64,46.92 74.83,47.72 | 75.64,46.92 74.83,46.12 | 87.31,38.41 C21.1
  Top 0.813: C8.1 68.26,67.63 68.58,67.31 | C10.+ 68.26,64.45 68.58,64.14 | 82.87,42.86 82.87,45.09
  Top 1.016: 82.87,42.86 v85.72,40.01 87.31,38.41
  Top 1.27: JP2.17 68.58,67.31 68.58,64.14 68.58,59.69 v67.63,58.74
  Top 1.778: IC3.4 69.22,5.11 69.22,15.88 | 69.22,15.88 R14.2 70.33,34.77 v71.75,36.2 | 69.22,15.88 C18.+
  Bottom 0.61: v85.72,40.01 86.68,40.01 86.84,40.16
  Bottom 0.813: JP2.17 JP2.18 | 50.16,52.7 v50.16,50.8
  Bottom 1.016: 49.05,53.82 50.16,52.7
  Bottom 1.778: v71.75,36.2 82.87,36.2 86.84,40.16 87,40.32 87,53.34 81.6,58.74 v67.63,58.74 53.98,58.74 49.05,53.82 v48.26,54.61
N$54
  Top 0.61: 27.62,36.2 33.34,41.91
N$55
  Top 0.406: 40.32,51.75 40.01,52.07
N$56
  Top 1.016: 37.07,46.38 37.06,49.1
N$57
  Top 0.305: 67.31,76.2 76.83,76.2 78.11,74.93
PD0
  Top 0.254: 76.2,41.36 IC4.30
  Top 0.406: 74.3,25.4 88.9,25.4 | 73.03,34.29 76.2,37.47 76.2,41.36
  Top 0.813: JP2.22 75.56,79.38 78.42,79.38
  Top 1.016: 88.9,25.4 98.42,34.92 98.42,59.37 78.42,79.38 | 74.3,25.4 73.03,26.67 73.03,34.29
PD1
  Top 0.406: IC4.31 76.93,36.92 74.3,34.29 74.3,32.38 | 74.93,31.75 92.08,31.75
  Top 0.61: 74.93,31.75 74.3,32.38
  Top 0.813: JP2.24 77.47,77.47 81.6,73.34
  Top 1.016: 92.08,31.75 96.52,36.2 96.52,58.42 81.6,73.34
PD6
  Top 0.406: IC4.10 76.93,74.2
  Top 1.016: 76.93,74.2 JP2.23 76.83,74.3 76.83,52.07
PD7
  Top 0.406: IC4.11 76.13,51.19 75.25,52.07
  Top 1.016: 75.25,52.07 75.25,73.34 JP2.21
SCLK
  Top 0.254: U$1.40 55.63,45.47
  Top 0.305: 55.63,45.47 55.88,45.72
  Top 0.406: 62.49,48.52 IC4.17 | JP1.7 60.96,49.53 59.05,49.53 58.42,48.9 58.42,48.26 55.88,45.72
  Top 0.61: JP1.7 62.49,48.52
START
  Top 0.254: U$1.38 55.86,44.47 57.15,43.18 57.15,39.37 58.42,38.1 63.5,38.1 66.67,41.27 71.98,41.27 IC4.25

### Text on the board
Bottom: (cc) by-nc-sa 2010 | jaseg